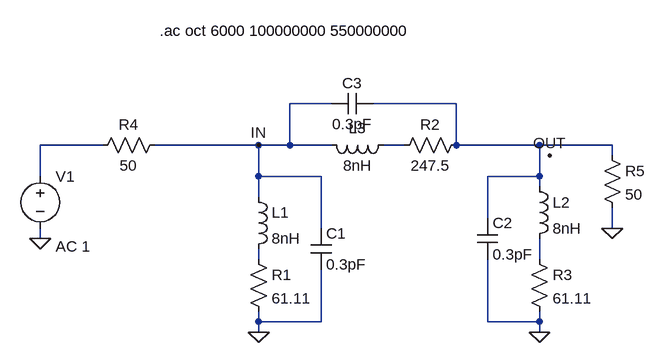
[diagram p0: schematic 20dB-UHF-unCompasation.asc]
20dB-UHF-unCompasation.asc, the LTspice schematic file:
Version 4
SHEET 1 920 680
WIRE 256 16 192 16
WIRE 448 16 320 16
WIRE -96 80 -192 80
WIRE 144 80 -16 80
WIRE 192 80 192 16
WIRE 192 80 144 80
WIRE 256 80 192 80
WIRE 368 80 336 80
WIRE 448 80 448 16
WIRE 576 80 448 80
WIRE 688 80 576 80
WIRE 688 96 688 80
WIRE -192 128 -192 80
WIRE 144 128 144 80
WIRE 240 128 144 128
WIRE 576 128 576 80
WIRE 576 128 496 128
WIRE 576 144 576 128
WIRE 144 160 144 128
WIRE 496 192 496 128
WIRE 240 208 240 128
WIRE 688 208 688 176
WIRE -192 224 -192 208
WIRE 144 256 144 240
WIRE 576 256 576 224
WIRE 144 352 144 336
WIRE 240 352 240 272
WIRE 240 352 144 352
WIRE 496 352 496 256
WIRE 576 352 576 336
WIRE 576 352 496 352
WIRE 144 368 144 352
WIRE 576 368 576 352
FLAG 144 368 0
FLAG 576 368 0
FLAG 688 208 0
FLAG -192 224 0
FLAG 144 80 IN
FLAG 592 96 OUT
SYMBOL res 128 240 R0
SYMATTR InstName R1
SYMATTR Value 61.11
SYMATTR SpiceLine tol=1 pwr=0.1
SYMBOL res 464 64 R90
WINDOW 0 0 56 VBottom 2
WINDOW 3 32 56 VTop 2
SYMATTR InstName R2
SYMATTR Value 247.5
SYMATTR SpiceLine tol=1 pwr=0.1
SYMBOL res 560 240 R0
SYMATTR InstName R3
SYMATTR Value 61.11
SYMATTR SpiceLine tol=1 pwr=0.1
SYMBOL res 0 64 R90
WINDOW 0 0 56 VBottom 2
WINDOW 3 32 56 VTop 2
SYMATTR InstName R4
SYMATTR Value 50
SYMATTR SpiceLine tol=1 pwr=0.1
SYMBOL res 672 80 R0
SYMATTR InstName R5
SYMATTR Value 50
SYMATTR SpiceLine tol=1 pwr=0.1
SYMBOL voltage -192 112 R0
WINDOW 123 24 124 Left 2
WINDOW 39 0 0 Left 2
SYMATTR Value2 AC 1
SYMATTR InstName V1
SYMATTR Value ""
SYMBOL ind 128 144 R0
SYMATTR InstName L1
SYMATTR Value 8nH
SYMATTR SpiceLine Ipk=0.39 Rser=0.47 Rpar=170 Cpar=0
SYMBOL ind 560 128 R0
SYMATTR InstName L2
SYMATTR Value 8nH
SYMBOL ind 240 64 M90
WINDOW 0 5 56 VBottom 2
WINDOW 3 32 56 VTop 2
SYMATTR InstName L3
SYMATTR Value 8nH
SYMBOL cap 224 208 R0
SYMATTR InstName C1
SYMATTR Value 0.3pF
SYMBOL cap 480 192 R0
SYMATTR InstName C2
SYMATTR Value 0.3pF
SYMBOL cap 320 0 R90
WINDOW 0 0 32 VBottom 2
WINDOW 3 32 32 VTop 2
SYMATTR InstName C3
SYMATTR Value 0.3pF
TEXT -8 -96 Left 2 !.ac oct 6000 100000000 550000000

The netlist it stands for:
* 20dB-UHF-unCompasation.asc
R1 N004 0 61.11 tol=1 pwr=0.1
R2 N001 N003 247.5 tol=1 pwr=0.1
R3 N005 0 61.11 tol=1 pwr=0.1
R4 IN N002 50 tol=1 pwr=0.1
R5 N001 0 50 tol=1 pwr=0.1
V1 N002 0 AC 1
L1 IN N004 8nH Ipk=0.39 Rser=0.47 Rpar=170 Cpar=0
L2 N001 N005 8nH
L3 IN N003 8nH
C1 IN 0 0.3pF
C2 N001 0 0.3pF
C3 N001 IN 0.3pF
.ac oct 6000 100000000 550000000
.backanno
.end